# EAGLE design comma_access_point (EAGLE 9.2.2)
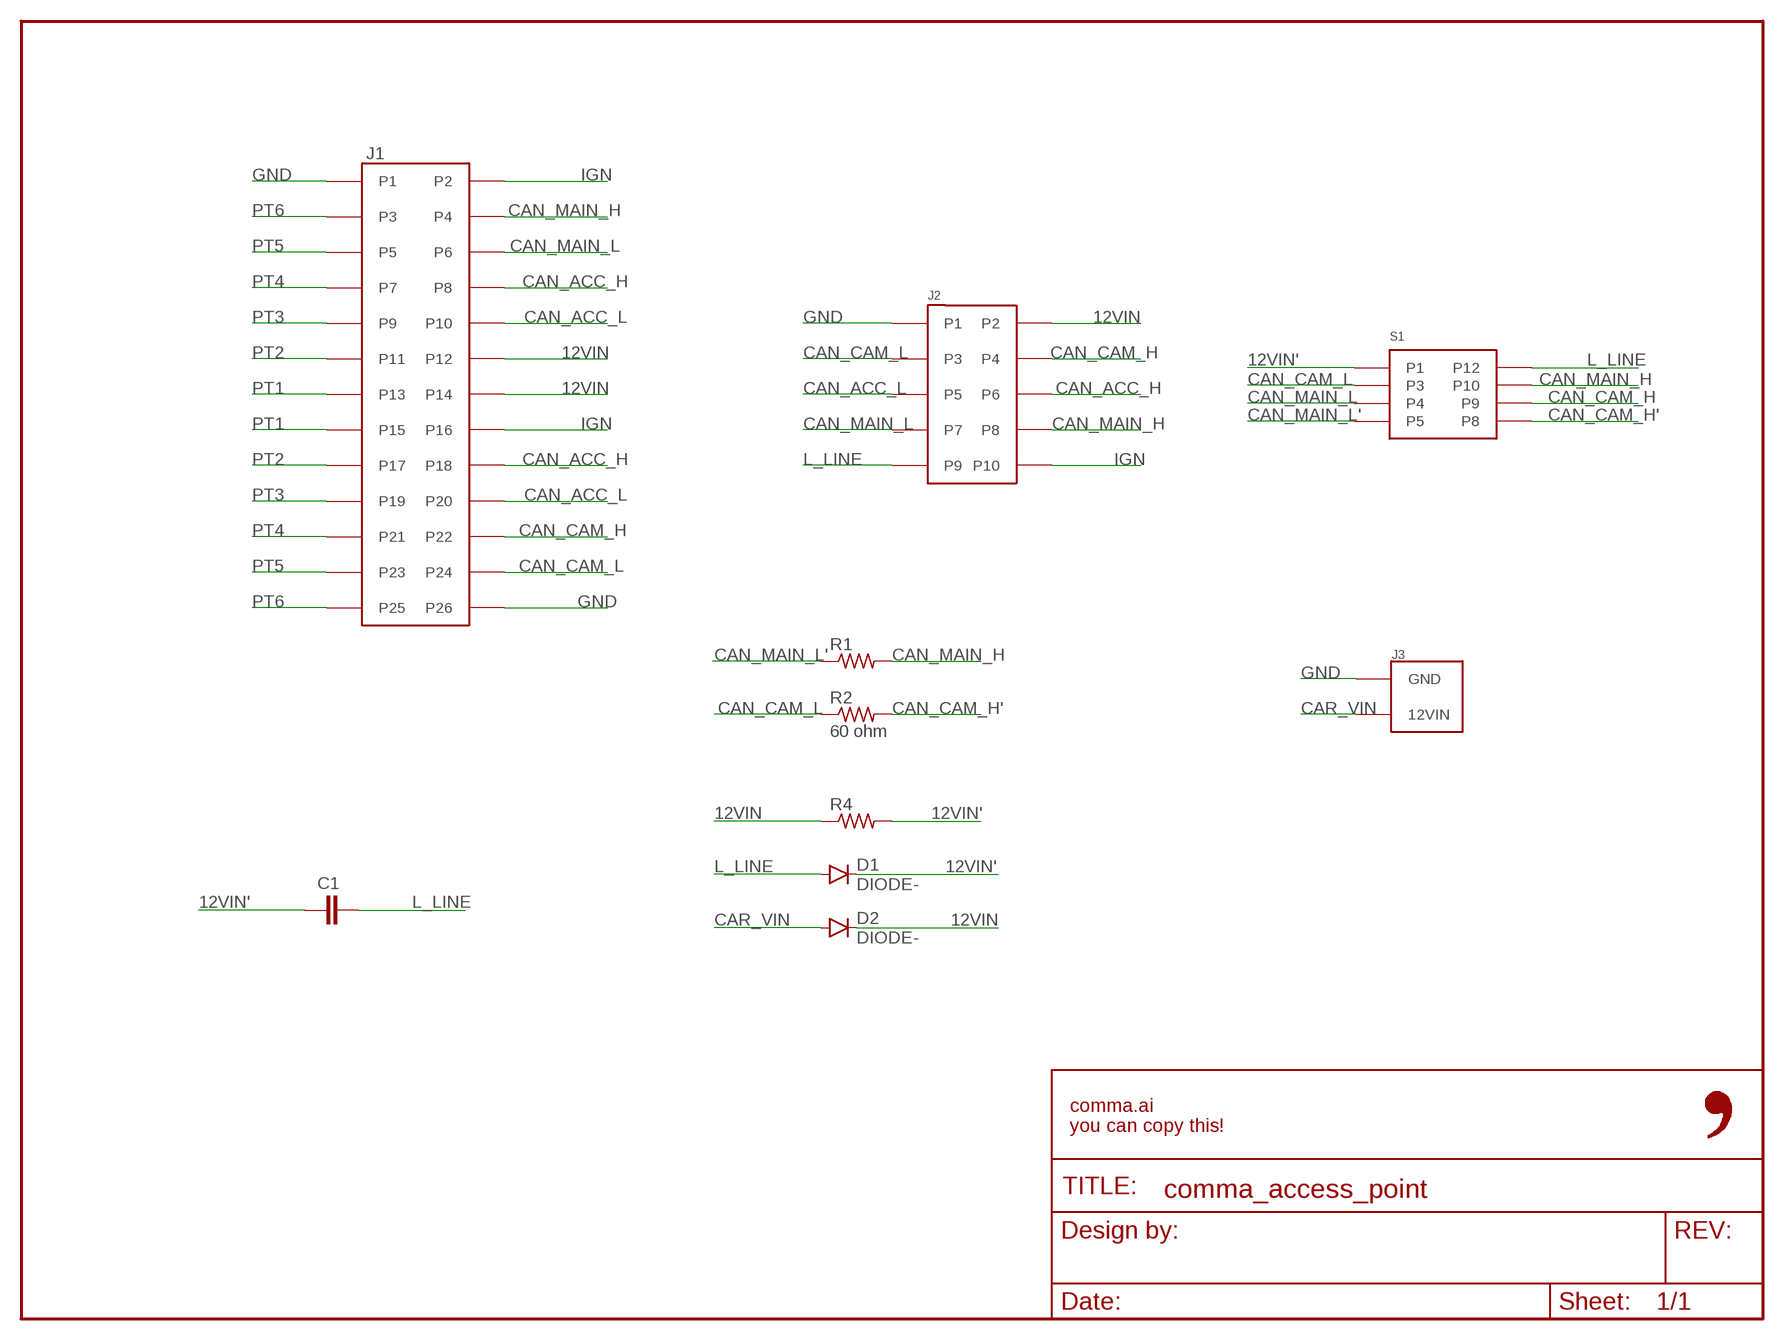
[diagram p0: schematic, sheet 1]

## Parts
C1  C0805  [0805-C]
D1  DIODE-  [DO-214]
D2  DIODE-  [DO-214]
FRAME1  FRAME-LETTER-OPENNO_PACKAGE  [DUMMY]
J1  5018762640  [5018762640]
J2  5018761040  [5018761040]
J3  3-794618-2  [3-794618-2]
R1  R0402  [0402-R]
R2  60 ohm  R0402  [0402-R]
R4  R0402  [0402-R]
S1  G6S-2G-DC12  [G6S-26-DC12]

## Nets
12VIN: D2.1(C) J1.P12 J1.P14 J2.P2 R4.1
12VIN': C1.1 D1.1(C) R4.2 S1.P1
CAN_ACC_H: J1.P8 J1.P18 J2.P6
CAN_ACC_L: J1.P10 J1.P20 J2.P5
CAN_CAM_H: J1.P22 J2.P4 S1.P9
CAN_CAM_H': R2.2 S1.P8
CAN_CAM_L: J1.P24 J2.P3 R2.1 S1.P3
CAN_MAIN_H: J1.P4 J2.P8 R1.2 S1.P10
CAN_MAIN_L: J1.P6 J2.P7 S1.P4
CAN_MAIN_L': R1.1 S1.P5
CAR_VIN: D2.2(A) J3.12VIN
GND: J1.P1 J1.P26 J2.P1 J3.GND
IGN: J1.P2 J1.P16 J2.P10
L_LINE: C1.2 D1.2(A) J2.P9 S1.P12
PT1: J1.P13 J1.P15
PT2: J1.P11 J1.P17
PT3: J1.P9 J1.P19
PT4: J1.P7 J1.P21
PT5: J1.P5 J1.P23
PT6: J1.P3 J1.P25

## Library data of the parts
C1 = comma.ai:C
D1 D2 = comma.ai:DIODE
FRAME1 = comma.ai:FRAME-LETTER-OPEN: Schematic Frame - Letter Standard 8.5x11 US Letter frame; DESIGNER: Nobody; VERSION: v01
J1 = 5018761440:5018762640
J2 = 5018761440:5018761040
J3 = 3-794618-2:3-794618-2
R1 R2 R4 = comma.ai:R
S1 = UD2-5SNU:G6S-2G-DC12

## Board
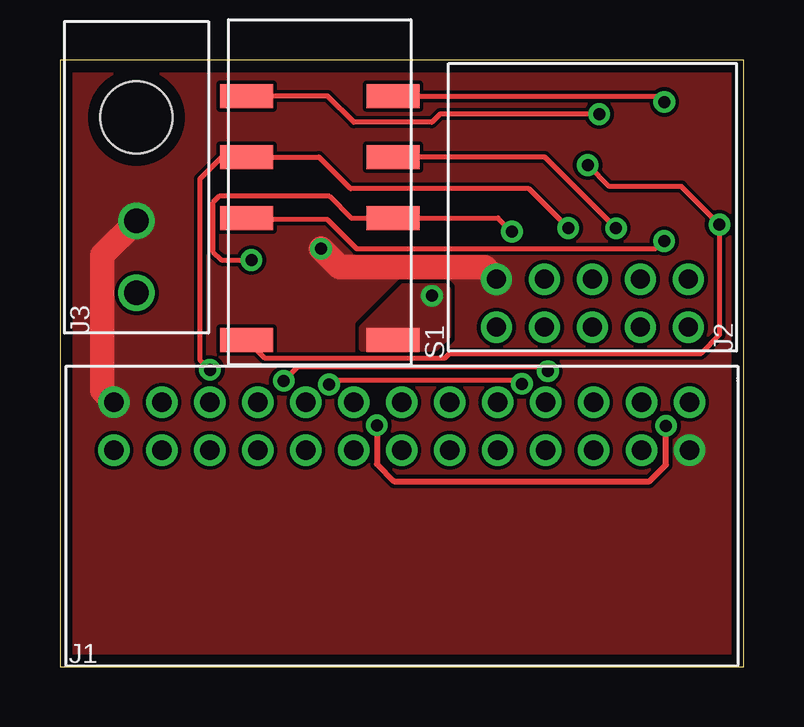
[diagram p1: board, top side]
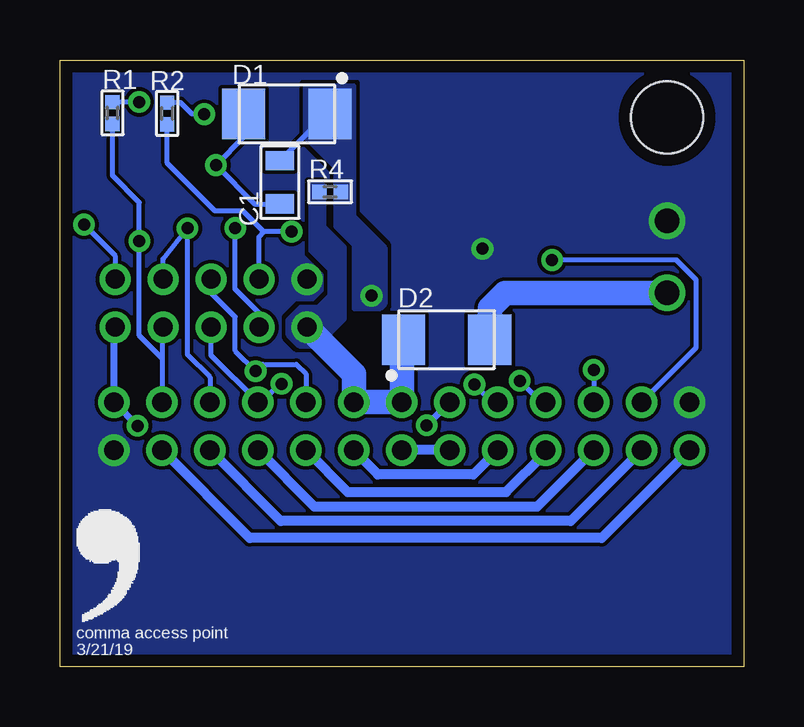
[diagram p2: board, bottom side, seen from below]

Size 28.5 x 25.3 mm. Coordinates in mm from the lower left corner, seen from the top.
Outline: 0,0 28.5,0 28.5,25.3 0,25.3 0,0
Copper layers (1*16): Top 0.035mm / dielectric 1.5mm / Bottom 0.035mm
Design rules "default *": minimum track width 6mil, minimum drill 0.35mm, track to track 6mil, track to pad 6mil, pad to pad 6mil, via to via 6mil, smd to smd 6mil, copper to edge 20mil, drill to drill 6mil, minimum pad ring 10mil, minimum via ring 8mil, stop-mask expansion 4mil, vias tented up to drill 0mil, thermal gap 10mil

### Footprints (pad centres in the part's own frame; a part is rotated, then mirrored left to right if it is on the bottom)
0805-C = smd 0.8 x 1.2: 1 -0.9,0; 2 0.9,0
DO-214 = smd 1.8 x 2.1: 1 -1.8,0; 2 1.8,0
5018762640 = drill 0.8: P1 12,-1; P2 12,1; P3 10,-1; P4 10,1; P5 8,-1; P6 8,1; P7 6,-1; P8 6,1; P9 4,-1; P10 4,1; P11 2,-1; P12 2,1; P13 0,-1; P14 0,1; P15 -2,-1; P16 -2,1; P17 -4,-1; P18 -4,1; P19 -6,-1; P20 -6,1; P21 -8,-1; P22 -8,1; P23 -10,-1; P24 -10,1; P25 -12,-1; P26 -12,1
5018761040 = drill 0.8: P1 5,-1; P2 5,1; P3 3,-1; P4 3,1; P5 1,-1; P6 1,1; P7 -1,-1; P8 -1,1; P9 -3,-1; P10 -3,1
3-794618-2 = drill 1.02: 12VIN 0,7.32; GND 0,4.32 | hole 3: 0,0
0402-R = smd 0.6 x 0.6: 1 -0.45,0; 2 0.45,0
G6S-26-DC12 = smd 1 x 2.2: P1 -6.35,-3.05; P3 -1.27,-3.05; P4 1.27,-3.05; P5 3.81,-3.05; P8 3.81,3.05; P9 1.27,3.05; P10 -1.27,3.05; P12 -6.35,3.05

### Placement (x,y rotation side)
C1  19.33,20.2 270 bottom
D1  19.04,23.04 180 bottom
D2  12.38,13.64 0 bottom
FRAME1  -6.35,8.89 0 top  (outside the outline)
J1  14.25,10.03 0 top
J2  23.2,15.16 180 top
J3  3.19,22.91 180 top
R1  26.31,23.09 270 bottom
R2  24.03,23.07 90 bottom
R4  17.24,19.8 0 bottom
S1  10.83,19.98 90 top
U$1  [LOGO]  28.46,1.57 0 bottom

### Tracks (layer width: path | path; a pad name or v marks a point on that pad's centre or on a via)
12VIN
  Bottom 1.016: J2.P2 16.25,12.21 J1.P12 J1.P14 14.25,13.57 D2.1
  pour Bottom (no thermals): 18.06,20.13 18.06,17.37 17.27,16.58 17.27,15.46 17.75,14.98 18.47,14.98 19.01,14.44 19.01,13.86 18.53,13.38 17.77,13.38 16.63,14.52 16.63,17.47 17.49,18.33 17.49,20.04 17.48,20.05 17.58,20.15 18.05,20.15
12VIN'  (via drill 0.5)
  Bottom 0.203: C1.1 17.39,23.04 D1.1
  other vias: 15.51,15.47
  pour Top (no thermals): 12.56,14.13 12.56,13.25 15.65,13.25 16.22,13.82 16.22,15.7 15.94,15.98 14.41,15.98
  pour Bottom (no thermals): 16.26,24.22 16.26,21.93 16.27,21.94 16.27,18.79 14.95,17.47 14.95,15.13 15.16,14.92 16.22,14.92 16.22,17.59 16.99,18.36 16.99,20.82 18.26,22.09 18.26,24.22
CAN_ACC_H  (via drill 0.5)
  Top 0.203: v19.27,11.8 19.14,11.92 19.13,11.94 11.4,11.94 v11.22,11.77
  Bottom 0.203: J2.P6 22.2,12.98 J1.P8 20.1,11.03 19.3,11.84 v19.27,11.8 | v11.22,11.77 10.48,11.03 J1.P18
CAN_ACC_L  (via drill 0.5)
  Top 0.203: v9.33,11.92 9.92,12.51 20.15,12.51 v20.34,12.32
  Bottom 0.203: J2.P5 22.2,15.59 21.19,14.58 21.19,13.17 v20.34,12.32 20.05,12.61 18.64,12.61 18.25,12.22 J1.P10 | v9.33,11.92 8.44,11.03 J1.P20
CAN_CAM_H  (via drill 0.5)
  Top 0.203: v6.25,12.38 5.83,12.8 5.83,20.34 6.74,21.25 S1.P9 10.8,21.25 12.12,19.93 19.55,19.93 v21.19,18.29
  Bottom 0.203: J2.P4 20.2,14.76 21.2,15.75 v21.2,18.28 v21.19,18.29 | v6.25,12.38 J1.P22
CAN_CAM_H'  (via drill 0.5)
  Top 0.203: S1.P8 11.16,23.79 12.25,22.7 15.51,22.7 15.85,23.04 v22.48,23.04
  Bottom 0.203: v22.48,23.04 23,23.04 23.48,23.52 R2.2
CAN_CAM_L  (via drill 0.5)
  Top 0.203: v7.98,16.96 6.73,16.96 6.37,17.32 6.37,19.35 6.64,19.62 11.23,19.62 12.14,18.71 S1.P3 18.27,18.71 v18.84,18.14
  Bottom 0.203: J1.P24 1.97,13.31 1.97,16.13 2.8,16.96 v7.98,16.96 | R2.1 24.03,20.99 22.04,19 20.87,19 20.01,18.14 19.98,18.14 | v18.84,18.14 19.98,18.14 | J2.P3 20.2,17.92 19.98,18.14
CAN_MAIN_H  (via drill 0.5)
  Top 0.203: S1.P10 7.84,18.65 11.15,18.65 12.37,17.43 24.82,17.43 25.14,17.75 v25.19,17.75
  Bottom 0.203: 24.23,12.86 24.23,11.05 J1.P4 | 24.23,12.86 25.19,13.82 v25.19,17.75 25.19,19.36 26.31,20.48 R1.2 | J2.P8 24.23,14.13 24.23,12.86
CAN_MAIN_L  (via drill 0.5)
  Top 0.203: v23.18,18.28 20.22,21.25 S1.P4
  Bottom 0.203: J1.P6 22.25,12.07 23.17,12.99 v23.18,18.28 24.2,17.01 J2.P7
CAN_MAIN_L'  (via drill 0.5)
  Top 0.203: v25.2,23.55 24.96,23.79 S1.P5
  Bottom 0.203: v25.2,23.55 v25.2,23.54 R1.1
CAR_VIN
  Bottom 1.016: J3.12VIN 9.94,15.59 10.57,14.96 D2.2
GND  (via drill 0.5)
  Top 1.016: J2.P1 17.7,16.66 11.66,16.66 v10.89,17.43 | J3.GND 1.76,17.16 1.76,11.52 J1.P26
  pour Top (rank 2, no thermals): -0.31,25.53 -0.31,-0.17 -0.21,-0.27 28.59,-0.27 28.89,0.03 28.89,25.33 28.59,25.63 -0.11,25.63
  pour Bottom (rank 2, no thermals): -0.31,25.63 -0.31,-0.17 -0.21,-0.27 28.59,-0.27 28.89,0.03 28.89,25.43 28.69,25.63
IGN  (via drill 0.5)
  Top 0.254: v13.21,10.07 13.21,8.45 13.93,7.73 24.58,7.73 25.27,8.42 v25.27,10.05
  Bottom 0.284: J2.P10 26.25,14.11 J1.P2 v25.27,10.05 | J1.P16 v13.21,10.07
L_LINE  (via drill 0.5)
  Top 0.203: v22,20.91 22.89,20.02 25.91,20.02 v27.5,18.43 27.5,13.85 26.71,13.06 16.24,13.06 16.06,12.88 8.53,12.88 S1.P12
  Bottom 0.203: D1.2 20.84,22.07 v22,20.91 20.39,19.3 C1.2 | J2.P9 26.2,17.14 v27.5,18.43
PT1
  Bottom 0.406: J1.P15 J1.P13
PT2
  Bottom 0.203: 16.25,9.01 J1.P11
  Bottom 0.406: J1.P17 11.27,8.01 15.25,8.01 16.25,9.01
PT3
  Bottom 0.406: J1.P9 16.5,7.29 9.9,7.29 8.25,8.94 J1.P19
PT4
  Bottom 0.406: J1.P21 8.61,6.67 17.89,6.67 J1.P7
PT5
  Bottom 0.406: J1.P23 7.2,6.08 19.3,6.08 J1.P5
PT6
  Bottom 0.406: J1.P25 5.91,5.37 20.59,5.37 J1.P3

### Text on the board
bPlace: comma access point | 3/21/19